# EAGLE design LPmini-Prototype_1.4 (EAGLE 6.4)
COMPANY: ADAFRUIT INDUSTRIES; DRAWN: KTOWN; REV: B
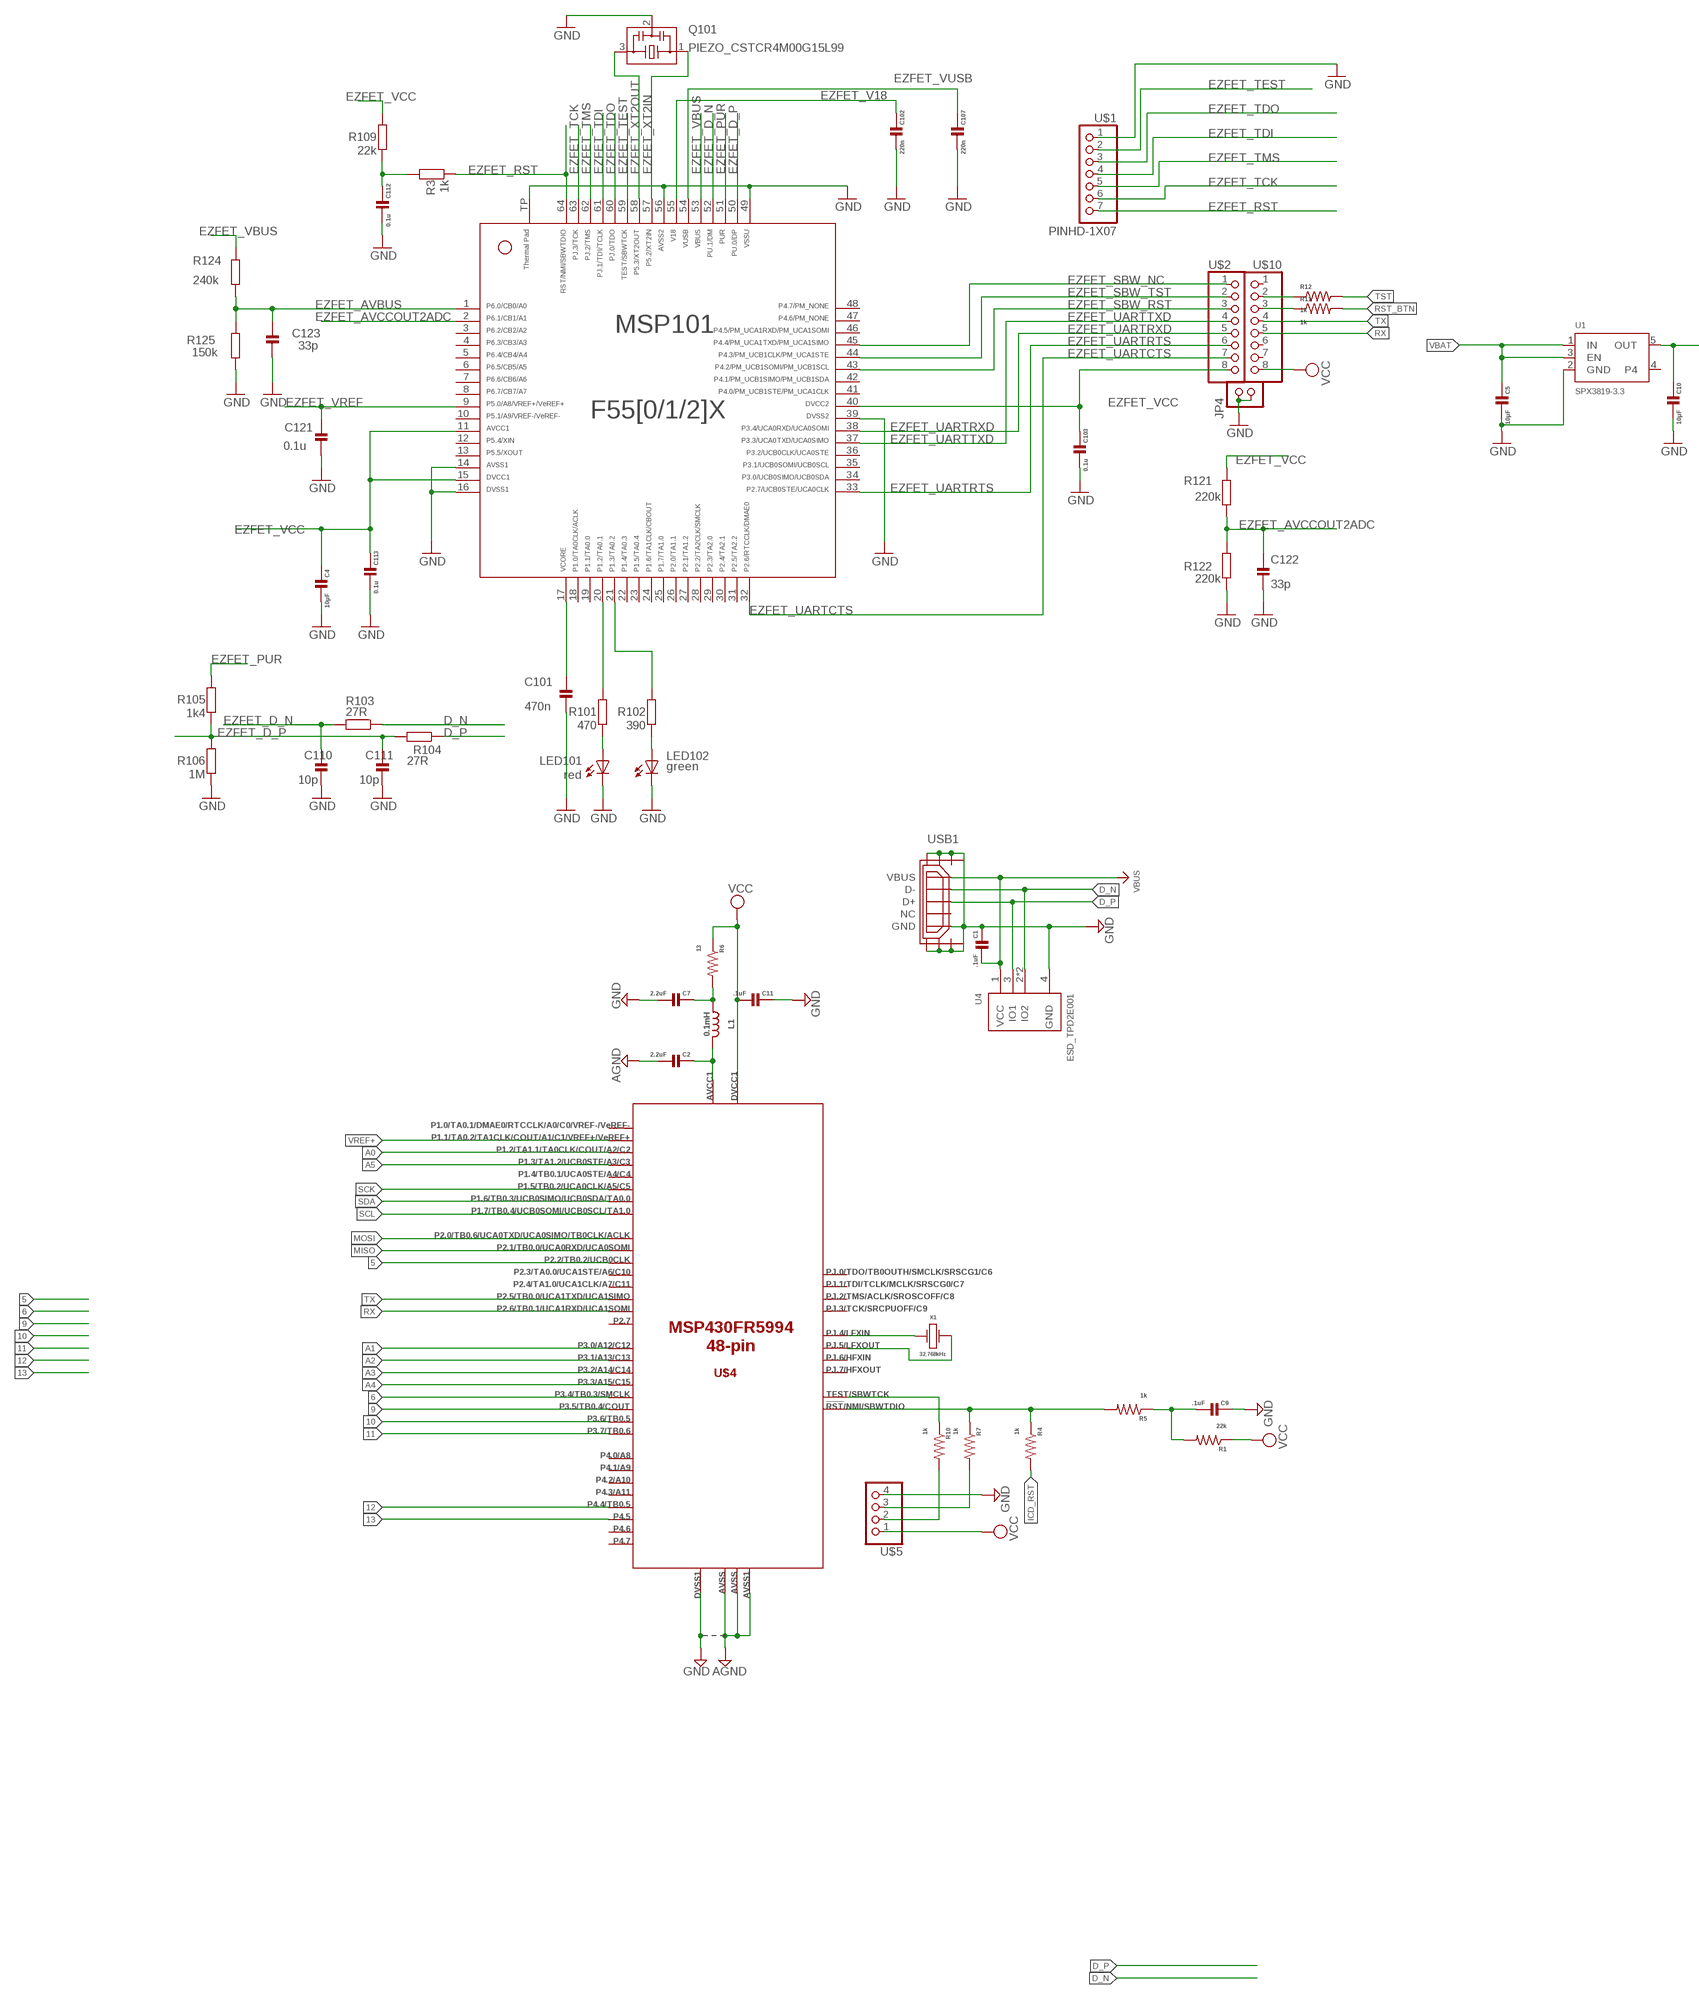
[diagram p0: schematic, sheet 1, part 1 of 2]
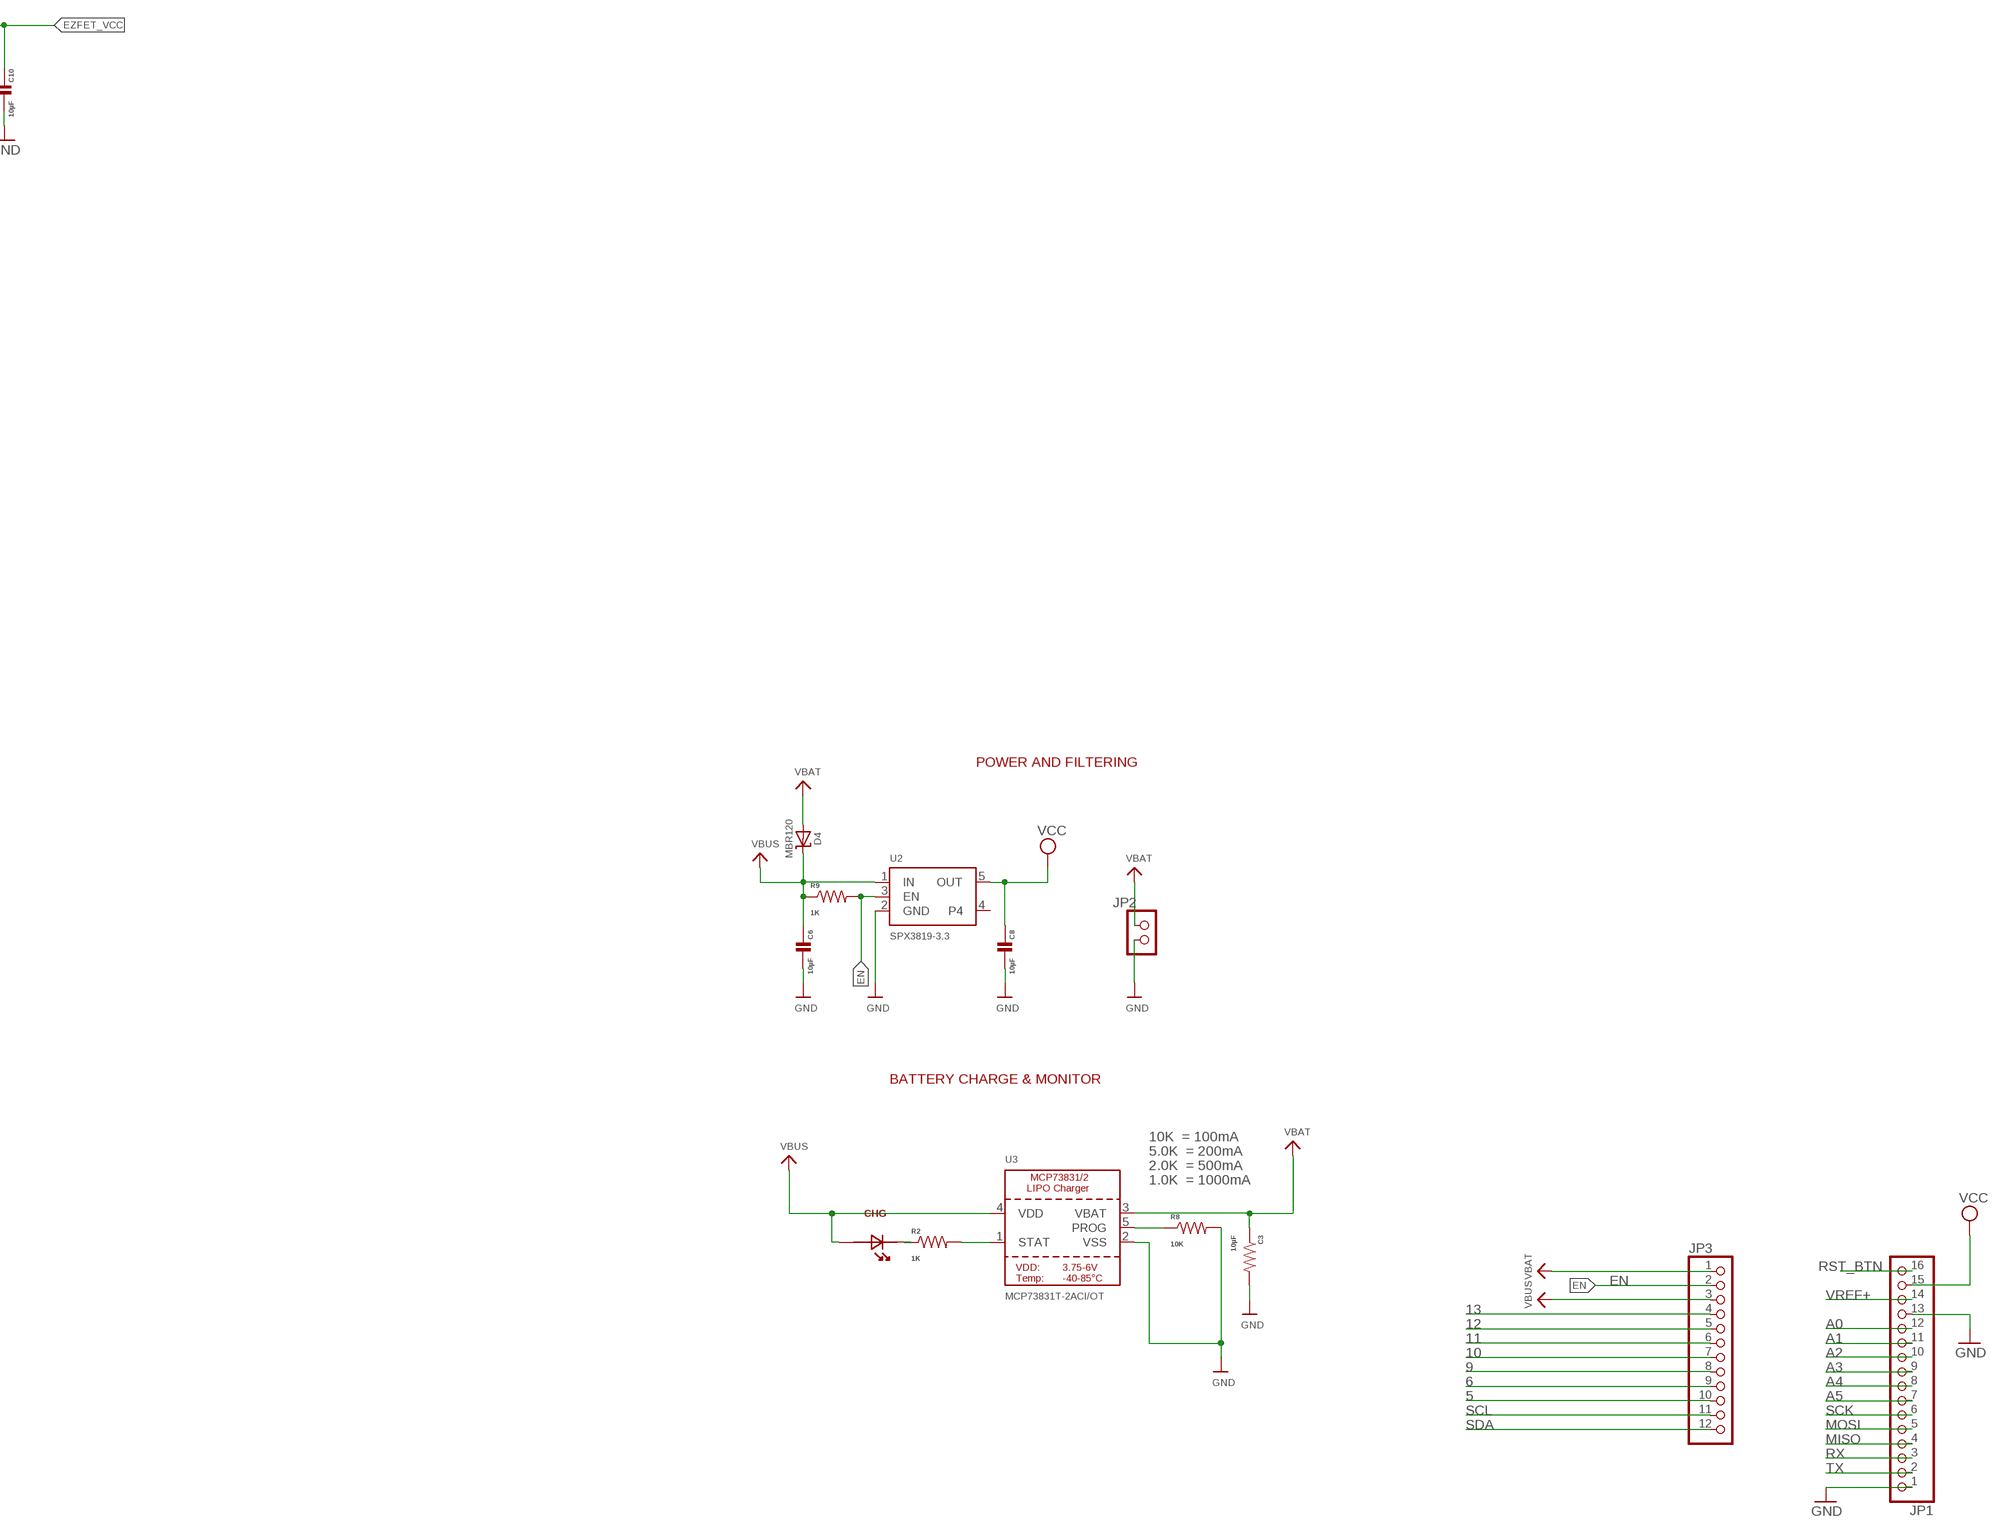
[diagram p1: schematic, sheet 1, part 2 of 2]

## Parts
C1  .1uF  C-EUC0402  [C0402]
C2  2.2uF  C-EUC0603  [C0603]
C3  10µF  R-US_R0402  [R0402]
C4  10µF  C-EUC0603  [C0603]
C5  10µF  C-EUC0603  [C0603]
C6  10µF  C-EUC0603  [C0603]
C7  2.2uF  C-EUC0603  [C0603]
C8  10µF  C-EUC0603  [C0603]
C9  .1uF  C-EUC0402  [C0402]
C10  10µF  C-EUC0603  [C0603]
C11  .1uF  C-EUC0402  [C0402]
C101  470n  C-EUC0402  [C0402]
C102  220n  C-EUC0402  [C0402]
C103  0.1u  C-EUC0402  [C0402]
C107  220n  C-EUC0402  [C0402]
C110  10p  C-EUC0402  [C0402]
C111  10p  C-EUC0402  [C0402]
C112  0.1u  C-EUC0402  [C0402]
C113  0.1u  C-EUC0402  [C0402]
C121  0.1u  C-EUC0402  [C0402]
C122  33p  C-EUC0402  [C0402]
C123  33p  C-EUC0402  [C0402]
CHG  ORANGE  LED0603  [LED_0603]
D4  MBR120  DIODE-SCHOTTKYSOD-123  [SOD-123]
JP1  HEADER-1X16ROUND  [1X16_ROUND]
JP2  0_JOSEPH_PINHD-1X2END  [0_JOSEPH_1X02-END]
JP3  HEADER-1X12  [1X12_ROUND]
JP4  0_JOSEPH_PINHD-1X2SMALL  [0_JOSEPH_1X02-SMALL]
L1  0.1mH  SMD_INDUCT0805  [RCL_R0805]
LED101  red  LEDCHIP-LED0603  [CHIP-LED0603]
LED102  green  LEDCHIP-LED0603  [CHIP-LED0603]
MSP101  MSP430F5528IRGC  F55[0/1/2]X---RGC64  [RGC64]
Q101  PIEZO_CSTCR4M00G15L99  MURATA-FILTER_CSTCR6M00G53Z  [MURATA-FILTER_CSTCR]
R1  22k  R-US_R0402  [R0402]
R2  1K  R-US_R0402  [R0402]
R3  1k  R-EU_R0402  [R0402]
R4  1k  R-US_R0402  [R0402]
R5  1k  R-US_R0402  [R0402]
R6  13  R-US_R0402  [R0402]
R7  1k  R-US_R0402  [R0402]
R8  10K  R-US_R0402  [R0402]
R9  1K  R-US_R0402  [R0402]
R10  1k  R-US_R0402  [R0402]
R11  1k  R-US_R0402  [R0402]
R12  1k  R-US_R0402  [R0402]
R101  470  R-EU_R0402  [R0402]
R102  390  R-EU_R0402  [R0402]
R103  27R  R-EU_R0402  [R0402]
R104  27R  R-EU_R0402  [R0402]
R105  1k4  R-EU_R0402  [R0402]
R106  1M  R-EU_R0402  [R0402]
R109  22k  R-EU_R0402  [R0402]
R121  220k  R-EU_R0402  [R0402]
R122  220k  R-EU_R0402  [R0402]
R124  240k  R-EU_R0402  [R0402]
R125  150k  R-EU_R0402  [R0402]
U1  SPX3819-3.3  VREG_SOT23-5  [SOT23-5]
U2  SPX3819-3.3  VREG_SOT23-5  [SOT23-5]
U3  MCP73831T-2ACI/OT  MCP73831/2  [SOT23-5]
U4  ESD_TPD2E001  [PROJECT7264_TPD2E001-DRL]
U$1  PINHD-1X07  [1X07]
U$2  PINHD-1X08SMALL  [1X08-SMALL]
U$4  MSP430FR5994-48PIN  [48QFN]
U$5  PINHD_1X4  [1X04]
U$10  PINHD-1X08SMALL  [1X08-SMALL]
USB1  USB_CON-UPDATE_USB_MICRO_FLIPPED  [USB_CON-UPDATE_HIROSE-ZX62R-B-5P]
X1  32.768kHz  CRYSTALABS-05  [CRYSTAL_ABS05]

## Nets
5: JP3.10 U$4.26
6: JP3.9 U$4.27
9: JP3.8 U$4.28
10: JP3.7 U$4.29
11: JP3.6 U$4.30
12: JP3.5 U$4.33
13: JP3.4 U$4.34
A0: JP1.12 U$4.3
A1: JP1.11 U$4.4
A2: JP1.10 U$4.5
A3: JP1.9 U$4.6
A4: JP1.8 U$4.7
A5: JP1.7 U$4.9
AGND: C2.2 U$4.41 U$4.44 U$4.47
D_N: R103.1 U4.2(IO2) U4.5(IO2) USB1.D-
D_P: R104.1 U4.3(IO1) USB1.D+
EN: JP3.2 R9.2 U2.3(EN)
EZFET_AVBUS: C123.2 MSP101.1 R124.2 R125.1
EZFET_AVCCOUT2ADC: C122.2 MSP101.2 R121.2 R122.1
EZFET_D_N: C110.1 MSP101.52 R103.2
EZFET_D_P: C111.1 MSP101.50 R104.2 R105.1 R106.2
EZFET_LED0: MSP101.20 R101.2
EZFET_LED1: MSP101.21 R102.2
EZFET_PUR: MSP101.51 R105.2
EZFET_RST: MSP101.64 R3.1 U$1.7
EZFET_SBW_NC: MSP101.45 U$2.1
EZFET_SBW_RST: MSP101.43 U$2.3
EZFET_SBW_TST: MSP101.44 U$2.2
EZFET_TCK: MSP101.63 U$1.6
EZFET_TDI: MSP101.61 U$1.4
EZFET_TDO: MSP101.60 U$1.3
EZFET_TEST: MSP101.59 U$1.2
EZFET_TMS: MSP101.62 U$1.5
EZFET_UARTCTS: MSP101.32 U$2.7
EZFET_UARTRTS: MSP101.33 U$2.6
EZFET_UARTRXD: MSP101.38 U$2.5
EZFET_UARTTXD: MSP101.37 U$2.4
EZFET_V18 [Ethernet]: C102.1 MSP101.55
EZFET_VBUS [Ethernet]: MSP101.53 R124.1
EZFET_VCC [Ethernet]: C4.1 C10.1 C103.1 C113.1 MSP101.11 MSP101.15 MSP101.40 R109.2 R121.1 U1.5(OUT) U$2.8
EZFET_VREF [Ethernet]: C121.1 MSP101.9
EZFET_VUSB [Ethernet]: C107.1 MSP101.54
EZFET_XT2IN: MSP101.57 Q101.1
EZFET_XT2OUT: MSP101.58 Q101.3
GND: C1.1 C3.2 C4.2 C5.2 C6.2 C7.2 C8.2 C9.1 C10.2 C11.1 C101.2 C102.2 C103.2 C107.2 C110.2 C111.2 C112.2 C113.2 C121.2 C122.1 C123.1 JP1.1 JP1.13 JP2.2 JP4.1 JP4.2 LED101.C LED102.C MSP101.14 MSP101.16 MSP101.39 MSP101.49 MSP101.56 MSP101.TP Q101.2 R8.2 R106.1 R122.2 R125.2 U1.2(GND) U2.2(GND) U3.2(VSS) U4.4(GND) U$1.1 U$4.36 U$4.TAB U$5.4 USB1.GND USB1.SHIELD1 USB1.SHIELD2 USB1.SHIELD3 USB1.SHIELD4 USB1.SHIELD5 USB1.SHIELD6
ICD_RST: R4.2
MISO: JP1.4 U$4.25
MOSI: JP1.5 U$4.24
N$1: CHG.K(C) R2.1
N$2: C9.2 R1.2 R5.1
N$3: R2.2 U3.1(STAT)
N$4: R8.1 U3.5(PROG)
N$5: U$4.46 X1.P$2
N$6: R11.1 U$10.3
N$7: R10.1 U$4.22
N$8: C112.1 R3.2 R109.1
N$9: R12.1 U$10.2
N$11: U$4.45 X1.P$1
N$14: C2.1 L1.1 U$4.48
N$15: C7.1 L1.2 R6.2
N$18: C101.1 MSP101.17
N$19: LED101.A R101.1
N$20: LED102.A R102.1
RST: R4.1 R5.2 R7.1 U$4.23
RST_BTN: JP1.16 R7.2 R11.2 U$5.3
RX: JP1.3 U$4.21 U$10.5
SCK: JP1.6 U$4.11
SCL: JP3.11 U$4.32
SDA: JP3.12 U$4.31
TST: R10.2 R12.2 U$5.2
TX: JP1.2 U$4.20 U$10.4
VBAT: C3.1 C5.1 D4.A JP2.1 JP3.1 U1.1(IN) U1.3(EN) U3.3(VBAT)
VBUS: C1.2 C6.1 CHG.A D4.C JP3.3 R9.1 U2.1(IN) U3.4(VDD) U4.1(VCC) USB1.VBUS
VCC: C8.1 C11.2 JP1.15 R1.1 R6.1 U2.5(OUT) U$4.37 U$5.1 U$10.8
VREF+: JP1.14 U$4.2
Unconnected: MSP101.3 MSP101.4 MSP101.5 MSP101.6 MSP101.7 MSP101.8 MSP101.10 MSP101.12 MSP101.13 MSP101.18 MSP101.19 MSP101.22 MSP101.23 MSP101.24 MSP101.25 MSP101.26 MSP101.27 MSP101.28 MSP101.29 MSP101.30 MSP101.31 MSP101.34 MSP101.35 MSP101.36 MSP101.41 MSP101.42 MSP101.46 MSP101.47 MSP101.48 U1.4 U2.4 U$4.1 U$4.8 U$4.10 U$4.12 U$4.13 U$4.14 U$4.15 U$4.16 U$4.17 U$4.18 U$4.19 U$4.35 U$4.38 U$4.39 U$4.40 U$4.42 U$4.43 U$10.1 U$10.6 U$10.7 USB1.NC

## Notes on the sheet
- POWER AND FILTERING
- BATTERY CHARGE & MONITOR
- 10K  = 100mA
- 5.0K  = 200mA
- 2.0K  = 500mA
- 1.0K  = 1000mA

## Library data of the parts
C1 C2 C4-C11 C101-C103 C107 C110-C113 C121-C123 = rcl:C-EU: CAPACITOR, European symbol
C3 R1 R2 R4-R12 = rcl:R-US_: RESISTOR, American symbol
CHG = 0Joseph:LED
D4 = microbuilder:DIODE-SCHOTTKY
JP1 = microbuilder:HEADER-1X16: PIN HEADER
JP2 JP4 = 0Joseph:0_JOSEPH_PINHD-1X2: PIN HEADER
JP3 = microbuilder:HEADER-1X12
L1 = 0Joseph:SMD_INDUCT
LED101 LED102 = led:LED: LED OSRAM: - CHIPLED LG R971, LG N971, LY N971, LG Q971, LY Q971, LO R971, LY R971 LH N974, LH R974 LS Q976, LO Q976, LY Q976 LO Q996 - Hyper CHIPLED LW Q18S LB Q993, LB Q99A, LB R99A - SideLED LS A670, LO A670, LY A670, LG A670, LP A670 LB A673, LV A673, LT A673, LW A673 LH A674 LY A675 LS A676, LA A676, LO A676, LY A676, LW A676 LS A679, LY A679, LG A679 - Hyper Micro SIDELED® LS Y876, LA Y876, LO Y876, LY Y876 LT Y87S - SmartLED LW L88C, LW L88S LB L89C, LB L89S, LG L890 LS L89K, LO L89K, LY L89K LS L896, LA L896, LO L896, LY L896 - TOPLED LS T670, LO T670, LY T670, LG T670, LP T670 LSG T670, LSP T670, LSY T670, LOP T670, LYG T670 LG T671, LOG T671, LSG T671 LB T673, LV T673, LT T673, LW T673 LH T674 LS T676, LA T676, LO T676, LY T676, LB T676, LH T676, LSB T676, LW T676 LB T67C, LV T67C, LT T67C, LS T67K, LO T67K, LY T67K, LW E67C LS E67B, LA E67B, LO E67B, LY E67B, LB E67C, LV E67C, LT E67C LW T67C LS T679, LY T679, LG T679 LS T770, LO T770, LY T770, LG T770, LP T770 LB T773, LV T773, LT T773, LW T773 LH T774 LS E675, LA E675, LY E675, LS T675 LS T776, LA T776, LO T776, LY T776, LB T776 LHGB T686 LT T68C, LB T68C - Hyper Mini TOPLED® LB M676 - Mini TOPLED Santana® LG M470 LS M47K, LO M47K, LY M47K Source: http://www.osram.convergy.de LUXEON: - LUMILED® LXK2-PW12-R00, LXK2-PW12-S00, LXK2-PW14-U00, LXK2-PW14-V00 LXK2-PM12-R00, LXK2-PM12-S00, LXK2-PM14-U00 LXK2-PE12-Q00, LXK2-PE12-R00, LXK2-PE12-S00, LXK2-PE14-T00, LXK2-PE14-U00 LXK2-PB12-K00, LXK2-PB12-L00, LXK2-PB12-M00, LXK2-PB14-N00, LXK2-PB14-P00, LXK2-PB14-Q00 LXK2-PR12-L00, LXK2-PR12-M00, LXK2-PR14-Q00, LXK2-PR14-R00 LXK2-PD12-Q00, LXK2-PD12-R00, LXK2-PD12-S00 LXK2-PH12-R00, LXK2-PH12-S00 LXK2-PL12-P00, LXK2-PL12-Q00, LXK2-PL12-R00 Source: www.luxeon.com KINGBRIGHT: KA-3528ASYC Source: www.kingbright.com
MSP101 = TI_MSP430_v16_intern:F55[0/1/2]X---RGC64: ***F55[0/1/2]X***RGC64 Rev. 1.0 06/2010 "http://www.ti.com/lit/gpn/msp430f5529" "http://www.ti.com/lit/gpn/msp430f5509" F5513/F5514 with limited Functions on some Pins
Q101 = murata:MURATA-FILTER_CSTCR: Resonator Source: murata.co.jp; MPN: CSTCR6M00G53-R0; OC_FARNELL: 1170434; OC_NEWARK: 25M8759
R3 R101-R106 R109 R121 R122 R124 R125 = rcl:R-EU_: RESISTOR, European symbol
U1 U2 = microbuilder:VREG_SOT23-5: SOT23-5 Fixed Voltage Regulators Part Current Out V Out V In V Dropout θJA (°C/W) TJ (°C) Digikey Part No. ADP121 150mA 3.3V 3.4-5.5V 0.09V @ 150mA -- -- ADP121-AUJZ33R7CT-ND ADP121 150mA 3.0V 3.1-5.5V 0.09V @ 150mA -- -- ADP121-AUJZ30R7CT-ND ADP122 300mA 3.3V 3.4-5.5V 0.085V @ 300mA -- -- ADP122AUJZ-3.3-R7CT-ND ADP1712 300mA 3.3V 3.5-5.5V 0.17V @ 300mA -- -- ADP1712AUJZ-3.3-R7TR-ND AP7311 (Low Cost) 150mA 3.3V 3.5-6V 0.15V @ 150mA -- -- AP7311-33WG-7DICT-ND LD39015M18R 150mA 1.8V 1.9V-5.5V 0.08V @ 100mA -- -- 497-6977-1-ND LP2985A-33DBVR 150mA 3.3V 3.3-16V 0.28V @ 150mA 206 150 296-18479-1-ND MCP1824T-3302E/OT 300mA 3.3V 3.5V-6V 0.2V @ 300mA -- -- MCP1824T-3302E/OTCT-ND MIC5205-2.5YM5 TR 150mA 2.5V 2.7-16V 0.165V @ 150mA -- -- 576-1257-2-ND MIC5205-3.0YM5 TR 150mA 3.0V 3.2V-16V 0.165V @ 150mA -- -- 576-1258-2-ND MIC5205-3.3YM5 TR 150mA 3.3V 3.5V-16V 0.165V @ 150mA -- -- 576-1259-2-ND TPS780330220 150mA 3.3V+2.2V 3.6-5.5V 250mV Max -- -- 296-23332-1-ND TDA3663/N1,135 100mA 3.3V 3.5-45V 0.18V @ 50mA -- -- 568-5343-1-ND Max operating temp can be calculated using θJA, TJ (max junction temperature), and power in watts. Set the "Maximum Ambient Temperature" until it reaches TJ ("Max Junction Temperature"), which is the absolute limit for safe use of the regulator: Heat Sink Temperature Calculator <http://www.daycounter.com/Calculators/Heat-Sink-Temperature-Calculator.phtml> For example, With 12V source into a 3.3V LP2985 and a 30mA load, we are dissipating (12V-3.3V) * 0.03A = 0.261W. With a θJA of 206 °C/W, a TJ of 150°C, and 261mW we can safely use the chip without a heat sink up to 75°C (=147.1°C Junction Temperature).
U3 = microbuilder:MCP73831/2: MCP73831/2 LIPO Charger VDD: 3.75 - 6V Temp -40 - 85°C Programmable Charge Rate: 15-500mA NOTE: STAT is a tri-state logic output on the MCP73831 and an open-drain output on the MCP73832. SOT23-5 with 4.2V output and tri-state logic on STAT = MCP73831T-2ACI/OT
U4 = 0Joseph:ESD_TPD2E001: TPD2E001 ESD-protection diode array
U$1 = 0Joseph:PINHD-1X07
U$2 U$10 = 0Joseph:PINHD-1X08
U$4 = 0Joseph:MSP430FR5994-48PIN
U$5 = 0Joseph:PINHD_1X4
USB1 = 0Joseph:USB_CON-UPDATE_USB_MICRO_FLIPPED
X1 = 0_Joseph:CRYSTAL

## Net classes
1 Ground: width 0.203 mm, drill 0.305 mm, clearance 0.152 mm to class 0, clearance 0.152 mm
2 Ethernet: width 0.22 mm, clearance 0.152 mm

## Board
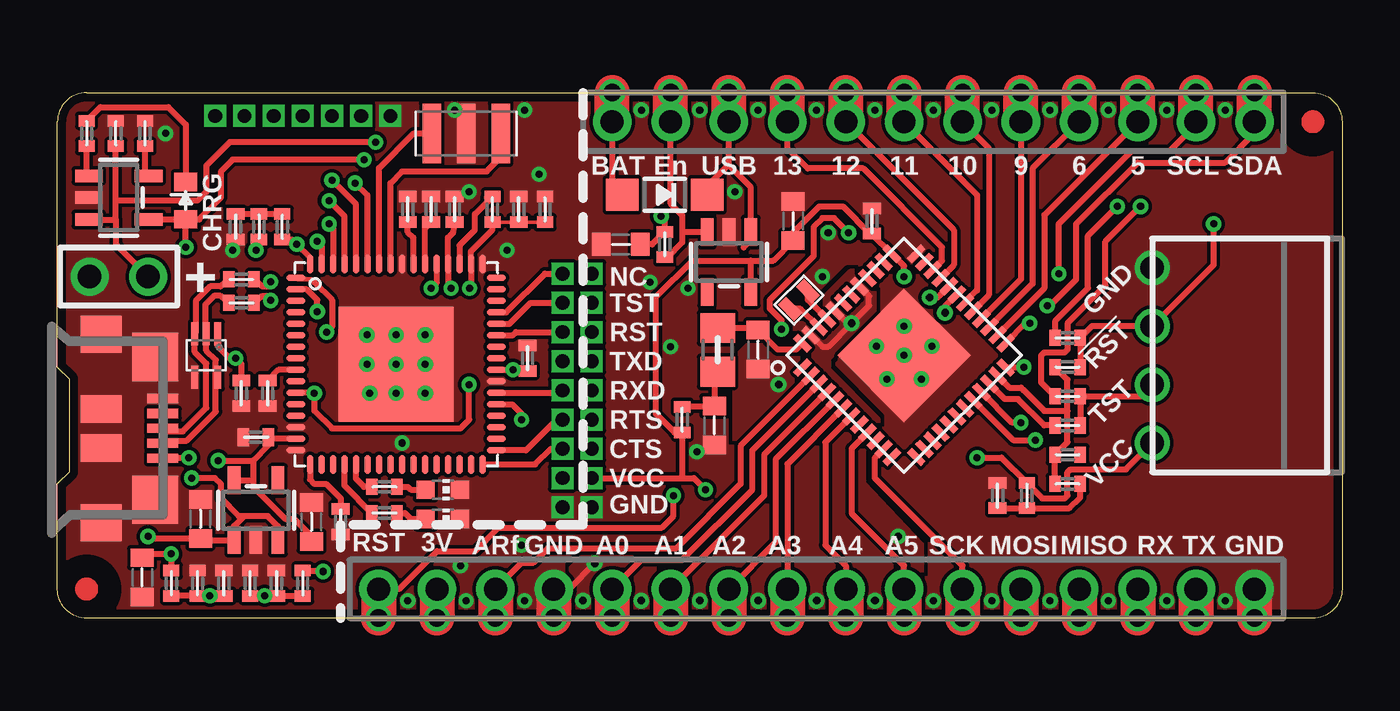
[diagram p2: board, top side]
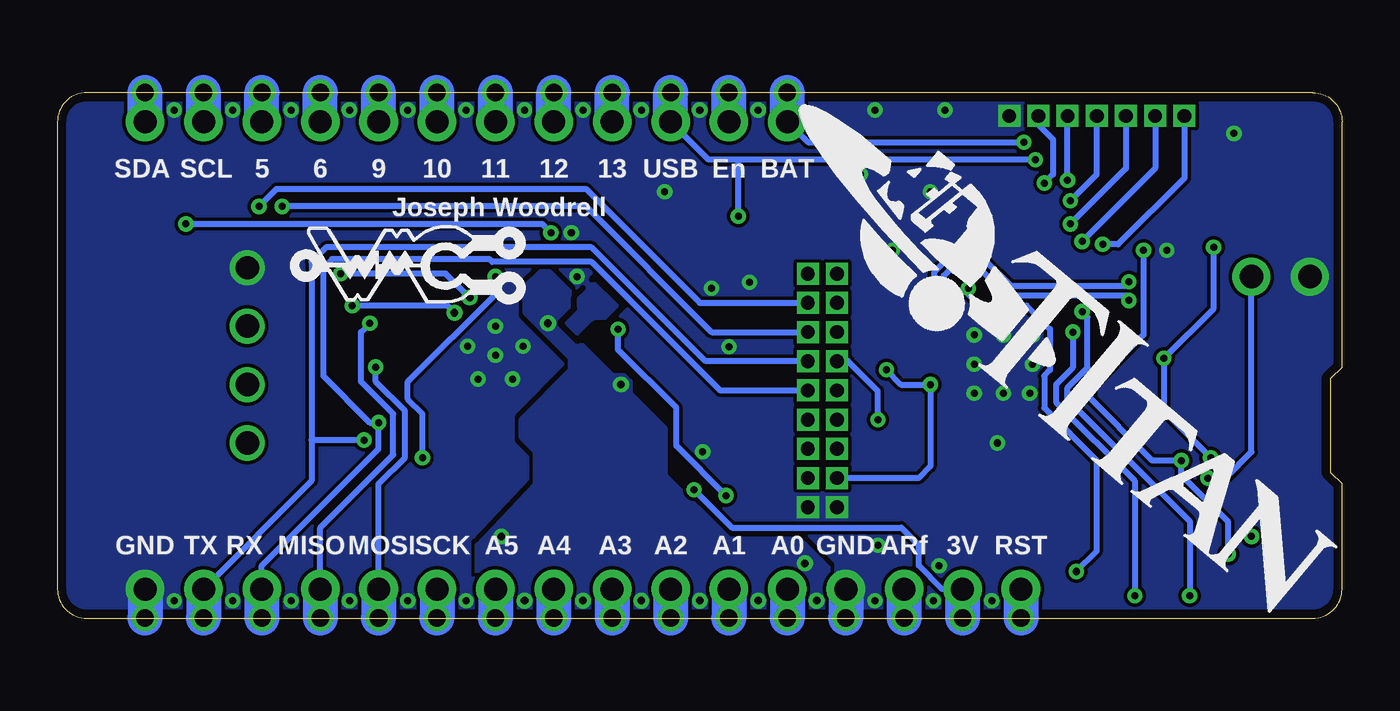
[diagram p3: board, bottom side, seen from below]

Size 55.88 x 22.86 mm. Coordinates in mm from the lower left corner, seen from the top.
Outline: 1.27,22.86 54.61,22.86 arc-90 55.88,21.59 55.88,1.27 arc-90 54.61,0 1.27,0 arc-90 0,1.27 0,5.84 0.51,6.35 0.51,10.41 0,10.92 0,21.59 arc-90 1.27,22.86
Copper layers (1*16): Top 0.0356mm / dielectric 1.5011mm / Bottom 0.0356mm
Design rules "JWoodrell": minimum track width 6mil, minimum drill 12mil, track to track 6mil, track to pad 6mil, pad to pad 6mil, via to via 6mil, smd to smd 0mil, copper to edge 15mil, drill to drill 6mil, minimum pad ring 7mil, minimum via ring 7mil, stop-mask expansion 1mil, vias tented up to drill 20mil, thermal gap 6mil
bRestrict: 9 lines

### Footprints (pad centres in the part's own frame; a part is rotated, then mirrored left to right if it is on the bottom)
C0402 = smd 0.5 x 0.775: 1 -0.55,0; 2 0.55,0
C0603 = smd 0.8 x 1: 1 -0.85,0; 2 0.85,0
R0402 = smd 0.5 x 0.7: 1 -0.55,0; 2 0.55,0
LED_0603 = smd 0.8 x 1: A -0.813,0; K 0.813,0
SOD-123 = smd 1.4 x 1.4: A 1.85,0; C -1.85,0
1X16_ROUND = drill 1 pad 1.676: 1 -19.05,0; 2 -16.51,0; 3 -13.97,0; 4 -11.43,0; 5 -8.89,0; 6 -6.35,0; 7 -3.81,0; 8 -1.27,0; 9 1.27,0; 10 3.81,0; 11 6.35,0; 12 8.89,0; 13 11.43,0; 14 13.97,0; 15 16.51,0; 16 19.05,0
0_JOSEPH_1X02-END = drill 1.016 pad 1.651: 1 -1.27,0; 2 1.27,0
1X12_ROUND = drill 1 pad 1.676: 1 -13.97,0; 2 -11.43,0; 3 -8.89,0; 4 -6.35,0; 5 -3.81,0; 6 -1.27,0; 7 1.27,0; 8 3.81,0; 9 6.35,0; 10 8.89,0; 11 11.43,0; 12 13.97,0
0_JOSEPH_1X02-SMALL = drill 0.6 pad 0.889 square: 1 -0.635,0; 2 0.635,0
RCL_R0805 = smd 1.3 x 1.5: 1 -0.95,0; 2 0.95,0
CHIP-LED0603 = smd 0.8 x 0.8: A 0,-0.75; C 0,0.75
RGC64 = smd 0.825 x 0.28: 1 -4.36,3.75; 2 -4.36,3.25; 3 -4.36,2.75; 4 -4.36,2.25; 5 -4.36,1.75; 6 -4.36,1.25; 7 -4.36,0.75; 8 -4.36,0.25; 9 -4.36,-0.25; 10 -4.36,-0.75; 11 -4.36,-1.25; 12 -4.36,-1.75; 13 -4.36,-2.25; 14 -4.36,-2.75; 15 -4.36,-3.25; 16 -4.36,-3.75; 33 4.36,-3.75; 34 4.36,-3.25; 35 4.36,-2.75; 36 4.36,-2.25; 37 4.36,-1.75; 38 4.36,-1.25; 39 4.36,-0.75; 40 4.36,-0.25; 41 4.36,0.25; 42 4.36,0.75; 43 4.36,1.25; 44 4.36,1.75; 45 4.36,2.25; 46 4.36,2.75; 47 4.36,3.25; 48 4.36,3.75 | smd 0.28 x 0.825: 17 -3.75,-4.36; 18 -3.25,-4.36; 19 -2.75,-4.36; 20 -2.25,-4.36; 21 -1.75,-4.36; 22 -1.25,-4.36; 23 -0.75,-4.36; 24 -0.25,-4.36; 25 0.25,-4.36; 26 0.75,-4.36; 27 1.25,-4.36; 28 1.75,-4.36; 29 2.25,-4.36; 30 2.75,-4.36; 31 3.25,-4.36; 32 3.75,-4.36; 49 3.75,4.36; 50 3.25,4.36; 51 2.75,4.36; 52 2.25,4.36; 53 1.75,4.36; 54 1.25,4.36; 55 0.75,4.36; 56 0.25,4.36; 57 -0.25,4.36; 58 -0.75,4.36; 59 -1.25,4.36; 60 -1.75,4.36; 61 -2.25,4.36; 62 -2.75,4.36; 63 -3.25,4.36; 64 -3.75,4.36 | smd 5 x 5: TP 0,0
MURATA-FILTER_CSTCR = smd 0.8 x 2.6: 1 -1.5,0; 2 0,0; 3 1.5,0
SOT23-5 = smd 0.55 x 1.2: 1 -0.95,-1.3; 2 0,-1.3; 3 0.95,-1.3; 4 0.95,1.3; 5 -0.95,1.3
PROJECT7264_TPD2E001-DRL = smd 0.3 x 1: 1 -0.5,-0.95; 2 0,-0.95; 3 0.5,-0.95; 4 0.5,0.95; 5 -0.5,0.95
1X07 = drill 0.6 pad 0.889 square: 1 -3.81,0; 2 -2.54,0; 3 -1.27,0; 4 0,0; 5 1.27,0; 6 2.54,0; 7 3.81,0
1X08-SMALL = drill 0.6 pad 0.889 square: 1 -4.445,0; 2 -3.175,0; 3 -1.905,0; 4 -0.635,0; 5 0.635,0; 6 1.905,0; 7 3.175,0; 8 4.445,0
48QFN = smd 0.3 x 0.85: 1 -2.75,-3.5; 2 -2.25,-3.5; 3 -1.75,-3.5; 4 -1.25,-3.5; 5 -0.75,-3.5; 6 -0.25,-3.5; 7 0.25,-3.5; 8 0.75,-3.5; 9 1.25,-3.5; 10 1.75,-3.5; 11 2.25,-3.5; 12 2.75,-3.5; 25 2.75,3.5; 26 2.25,3.5; 27 1.75,3.5; 28 1.25,3.5; 29 0.75,3.5; 30 0.25,3.5; 31 -0.25,3.5; 32 -0.75,3.5; 33 -1.25,3.5; 34 -1.75,3.5; 35 -2.25,3.5; 36 -2.75,3.5 | smd 0.85 x 0.3: 13 3.5,-2.75; 14 3.5,-2.25; 15 3.5,-1.75; 16 3.5,-1.25; 17 3.5,-0.75; 18 3.5,-0.25; 19 3.5,0.25; 20 3.5,0.75; 21 3.5,1.25; 22 3.5,1.75; 23 3.5,2.25; 24 3.5,2.75; 37 -3.5,2.75; 38 -3.5,2.25; 39 -3.5,1.75; 40 -3.5,1.25; 41 -3.5,0.75; 42 -3.5,0.25; 43 -3.5,-0.25; 44 -3.5,-0.75; 45 -3.5,-1.25; 46 -3.5,-1.75; 47 -3.5,-2.25; 48 -3.5,-2.75 | smd 4.1 x 4.1: TAB 0,0
1X04 = drill 1.016: 1 -3.81,0; 2 -1.27,0; 3 1.27,0; 4 3.81,0
USB_CON-UPDATE_HIROSE-ZX62R-B-5P = smd 1.35 x 0.4: D+ 2.675,0; D- 2.675,-0.65; GND 2.675,1.3; NC 2.675,0.65; VBUS 2.675,-1.3 | smd 1.778 x 1.6: SHIELD1 0,4.1; SHIELD2 0,-4.1 | smd 2 x 2.1: SHIELD3 2.35,3.1; SHIELD4 2.35,-3.1 | smd 1.778 x 1.2: SHIELD5 0,0.85; SHIELD6 0,-0.85
CRYSTAL_ABS05 = smd 0.5 x 1: P$1 -0.55,0; P$2 0.55,0

### Placement (x,y rotation side)
C1  8,9.78 90 top
C2  30.48,11.68 270 top
C3  2.54,21.08 90 top
C4  3.68,1.78 270 top
C5  6.22,4.32 90 top
C6  24.51,16.26 180 top
C7  28.57,8.38 270 top
C8  32,17.27 90 top
C9  40.89,5.33 270 top
C10  11.05,4.19 90 top
C11  35.43,17.27 270 top
C101  12.32,4.19 270 top
C102  15.24,17.78 90 top
C103  8.64,7.87 180 top
C107  16.26,17.78 90 top
C110  17.27,17.78 90 top
C111  20.07,17.78 90 top
C112  7.75,17.02 270 top
C113  20.45,11.3 90 top
C121  9.14,9.78 270 top
C122  7.24,1.52 270 top
C123  9.53,1.52 270 top
CHG  5.59,18.16 90 top
D4  26.42,18.41 180 top
JP1  33.02,1.27 180 top
JP2  2.67,14.86 180 top
JP3  38.1,21.59 0 top
JP4  22.61,4.83 0 top
L1  28.72,11.67 270 top
LED101  16.76,4.32 270 top
LED102  16.76,5.59 270 top
MSP101  14.73,11.05 0 top
Q101  17.78,21.08 180 top
R1  42.16,5.33 270 top
R2  1.27,21.08 270 top
R3  9.78,17.02 90 top
R4  43.94,7.11 0 top
R5  43.94,5.84 180 top
R6  27.18,8.64 90 top
R7  43.94,10.92 0 top
R8  3.81,21.08 90 top
R9  26.42,16.26 270 top
R10  43.94,8.38 0 top
R11  43.94,12.19 0 top
R12  43.94,9.65 0 top
R101  14.22,4.57 180 top
R102  14.22,5.71 180 top
R103  8,13.72 0 top
R104  8,14.73 0 top
R105  18.92,17.78 90 top
R106  21.21,17.78 270 top
R109  8.76,17.02 270 top
R121  4.95,1.52 270 top
R122  6.1,1.52 90 top
R124  10.67,1.52 270 top
R125  8.38,1.52 90 top
U1  8.64,4.7 0 top
U2  29.21,15.49 180 top
U3  2.67,18.29 270 top
U4  6.48,11.43 180 top
U$1  10.67,21.84 180 top
U$2  21.97,10.54 270 top
U$4  36.83,11.43 315 top
U$5  47.62,11.43 90 top
U$7  [TITAN_LOGO]  11.86,10.7 320 bottom
U$8  [FIDUCIAL]  1.27,1.27 0 top
U$9  [FIDUCIAL]  54.61,21.59 0 top
U$10  23.24,10.54 270 top
U$11  [WMC_LOGO_400MILWIDE]  45.72,13.72 0 bottom
USB1  1.91,8.25 0 top
X1  32.26,13.84 225 top

### Tracks (layer width: path | path; a pad name or v marks a point on that pad's centre or on a via)
5  (via drill 0.76)
  Top 0.254: JP3.10 42.93,17.53 42.93,14.34 U$4.26
  Top 1.524: JP3.10 v46.99,22.86
  Bottom 1.524: JP3.10 v46.99,22.86
6  (via drill 0.76)
  Top 0.254: JP3.9 42.42,19.56 42.42,14.54 U$4.27
  Top 1.524: JP3.9 v44.45,22.86
  Bottom 1.524: JP3.9 v44.45,22.86
9  (via drill 0.76)
  Top 0.254: JP3.8 41.91,14.74 U$4.28
  Top 1.524: JP3.8 v41.91,22.86
  Bottom 1.524: JP3.8 v41.91,22.86
10  (via drill 0.76)
  Top 0.254: JP3.7 40.51,20.45 40.51,14.05 U$4.29
  Top 1.524: JP3.7 v39.37,22.86
  Bottom 1.524: JP3.7 v39.37,22.86
11  (via drill 0.76)
  Top 0.254: JP3.6 40.01,18.41 40.01,14.25 U$4.30
  Top 1.524: JP3.6 v36.83,22.86
  Bottom 1.524: JP3.6 v36.83,22.86
12  (via drill 0.76)
  Top 0.254: JP3.5 38.99,16.89 38.99,15.36 U$4.33
  Top 1.524: JP3.5 v34.29,22.86
  Bottom 1.524: JP3.5 v34.29,22.86
13  (via drill 0.76)
  Top 0.254: U$4.34 38.48,15.56 38.48,16.13 35.05,19.56 32.64,19.56 31.75,20.45 JP3.4
  Top 1.524: JP3.4 v31.75,22.86
  Bottom 1.524: JP3.4 v31.75,22.86
A0  (via drill 0.76)
  Top 0.254: JP1.12 25.4,2.54 27.18,2.54 30.23,5.59 30.23,7.3 U$4.3
  Top 1.524: JP1.12 v24.13,0
  Bottom 1.524: JP1.12 v24.13,0
A1  (via drill 0.76)
  Top 0.254: U$4.4 30.73,7.1 30.73,5.33 JP1.11
  Top 1.524: JP1.11 v26.67,0
  Bottom 1.524: JP1.11 v26.67,0
A2  (via drill 0.76)
  Top 0.254: U$4.5 31.24,6.9 31.24,3.3 JP1.10
  Top 1.524: JP1.10 v29.21,0
  Bottom 1.524: JP1.10 v29.21,0
A3  (via drill 0.76)
  Top 0.254: U$4.6 31.75,6.7 JP1.9
  Top 1.524: JP1.9 v31.75,0
  Bottom 1.524: JP1.9 v31.75,0
A4  (via drill 0.76)
  Top 0.254: JP1.8 34.29,2.29 33.4,3.17 33.4,7.65 U$4.7
  Top 1.524: JP1.8 v34.29,0
  Bottom 1.524: JP1.8 v34.29,0
A5  (via drill 0.76)
  Top 0.254: U$4.9 34.54,7.38 34.54,4.57 36.83,2.29 JP1.7
  Top 1.524: JP1.7 v36.83,0
  Bottom 1.524: JP1.7 v36.83,0
AGND  (via drill 0.33)
  Top 0.254: U$4.47 33.27,11.81 33.53,11.81 v34.54,12.83 34.61,12.89 | 34.61,12.89 35.31,13.59 35.31,14.02 U$4.41 | U$4.44 34.44,12.76 34.61,12.89 | v23.37,2.39 22.25,1.27 21.79,1.27
  other vias: 31.37,10.16 25.4,0.76 27.94,0.76 30.48,0.76 33.02,0.76 35.56,0.76 36.58,3.56 22.86,0.76
  pour Top (no thermals): 37.59,-0.38 37.59,3.17 35.05,5.84 35.05,7.24 35.69,7.87 35.69,8.64 33.53,10.79 33.53,11.3 35.51,13.28 35.51,14.4 34.85,15.06 34.49,15.06 33.4,13.97 33.4,13.46 34.04,12.83 33.27,12.06 32.51,12.83 30.99,12.83 29.46,11.3 29.46,6.22 26.67,3.43 23.62,3.43 22.35,2.16 22.35,-0.38
  pour Bottom (no thermals): 37.59,-0.38 37.59,3.17 35.05,5.84 35.05,7.24 35.69,7.87 35.69,8.64 33.53,10.79 33.53,11.3 35.51,13.28 35.51,14.4 34.85,15.06 34.49,15.06 33.4,13.97 33.4,13.46 34.04,12.83 34.04,12.83 31.75,10.54 31.24,10.54 30.99,10.29 30.99,9.78 29.46,8.25 29.46,6.22 26.67,3.43 23.62,3.43 22.35,2.16 22.35,-0.38
D_N
  Top 0.152: U4.5 6.97,10.49 6.88,10.49
  Top 0.254: USB1.D- 4.7,7.72 5.62,7.72 6.88,8.98 6.88,10.49 6.88,11.23 6.48,11.64 U4.2 6.43,12.43 6.43,13.63 6.82,14.02 7.1,14.02 R103.1
D_P
  Top 0.254: USB1.D+ 4.71,8.13 5.45,8.13 6.48,9.15 6.48,11.07 5.98,11.57 U4.3 6.02,12.42 6.02,13.8 6.65,14.43 7.1,14.43 R104.1
EN  (via drill 0.76)
  Top 0.254: JP3.2 26.67,18.03 27.18,17.53 27.18,16.79 | 27.18,16.79 27.18,16.34 26.54,15.71 R9.2 | U2.3 27.18,16.79
  Top 1.524: JP3.2 v26.67,22.86
  Bottom 1.524: JP3.2 v26.67,22.86
EZFET_AVBUS  (via drill 0.3)
  Top 0.203: MSP101.1 10.44,14.73 11.05,14.73 11.18,14.61
  Top 0.254: R125.1 v9.02,0.97 C123.2 R124.2 | v11.71,12.45 11.94,12.68 11.94,13.84 11.18,14.61
  Bottom 0.254: v11.71,12.45 11.71,10.9 12.45,10.16 12.45,9.4 9.02,5.97 v9.02,0.97
EZFET_AVCCOUT2ADC  (via drill 0.3)
  Top 0.254: C122.2 v6.63,0.97 R122.1 R121.2 | v11.3,13.33 11.3,13.84 10.85,14.3 MSP101.2
  Bottom 0.254: v11.3,13.33 11.07,13.11 11.07,10.9 11.94,10.03 11.94,9.53 6.63,4.22 v6.63,0.97
EZFET_D_N  (via drill 0.3)
  Top 0.254: C110.1 17.22,16.79 16.98,16.55 MSP101.52 16.98,14.49 v17.12,14.35 | R103.2 8.91,14.02 9.27,14.02 v9.27,13.82
  Bottom 0.254: v9.27,13.82 9.27,14.02 14.56,14.02 15.71,15.16 17.06,15.16 17.32,14.9 17.32,14.35 v17.12,14.35
EZFET_D_P  (via drill 0.3)
  Top 0.152: R105.1 C111.1 R106.2
  Top 0.254: R105.1 18.92,16.89 17.98,15.95 MSP101.50 17.98,14.4 v17.93,14.35 | R104.2 8.91,14.43 9.27,14.43 v9.27,14.63
  Bottom 0.254: v9.27,14.63 9.27,14.43 14.39,14.43 15.54,15.57 17.23,15.57 17.73,15.07 17.73,14.35 v17.93,14.35
EZFET_LED0
  Top 0.254: R101.2 12.48,5.76 MSP101.20
EZFET_LED1
  Top 0.254: R102.2 13.34,5.71 12.98,6.07 MSP101.21
EZFET_PUR
  Top 0.254: MSP101.51 17.48,16.21 18.16,16.89 18.16,17.57 R105.2 18.67,18.29
EZFET_RST  (via drill 0.3)
  Top 0.254: MSP101.64 10.98,15.69 v10.41,16.26 10.2,16.47 R3.1
  Bottom 0.254: U$1.7 6.86,19.14 9.74,16.26 v10.41,16.26
EZFET_SBW_NC
  Top 0.254: MSP101.45 19.52,13.3 21.21,14.99 U$2.1
EZFET_SBW_RST
  Top 0.254: MSP101.43 19.79,12.3 19.94,12.45 U$2.3
EZFET_SBW_TST
  Top 0.254: MSP101.44 19.66,12.8 20.57,13.72 U$2.2
EZFET_TCK  (via drill 0.3)
  Top 0.254: v11.3,16.38 11.48,16.2 MSP101.63
  Bottom 0.254: U$1.6 8.13,19.56 v11.3,16.38
EZFET_TDI  (via drill 0.3)
  Top 0.254: MSP101.61 12.48,17.49 v11.81,18.16
  Bottom 0.254: v11.81,18.16 10.67,19.3 U$1.4
EZFET_TDO  (via drill 0.3)
  Top 0.254: MSP101.60 12.98,18.01 v11.94,19.05
  Bottom 0.254: v11.94,19.05 U$1.3
EZFET_TEST  (via drill 0.3)
  Top 0.254: MSP101.59 13.48,18.39 v12.95,18.92
  Bottom 0.254: U$1.2 13.21,21.46 12.57,20.83 12.57,19.3 v12.95,18.92
EZFET_TMS  (via drill 0.3)
  Top 0.254: v11.81,17.14 11.98,16.97 MSP101.62
  Bottom 0.254: U$1.5 9.4,19.56 v11.81,17.14
EZFET_UARTCTS
  Top 0.254: MSP101.32 20.79,6.69 21.46,7.37 U$2.7
EZFET_UARTRTS
  Top 0.254: MSP101.33 20.38,7.3 21.72,8.64 U$2.6
EZFET_UARTRXD
  Top 0.254: MSP101.38 21.86,9.8 U$2.5
EZFET_UARTTXD  (via drill 0.3)
  Top 0.254: MSP101.37 19.78,9.3 20.19,8.89 v20.19,8.64
  Bottom 0.254: v20.19,8.64 20.19,9.88 21.49,11.18 U$2.4
EZFET_V18
  Top 0.254: MSP101.55 15.48,16.55 15.24,16.79 C102.1
EZFET_VBUS  (via drill 0.3)
  Top 0.254: MSP101.53 16.48,14.58 v16.26,14.35 | v11.56,2.03 10.71,2.03 R124.1
  Bottom 0.254: v16.26,14.35 16.26,14.1 15.75,13.59 13.72,13.59 12.7,12.57 12.7,10.79 12.95,10.54 12.95,9.14 10.67,6.86 10.67,2.92 v11.56,2.03
EZFET_VCC  (via drill 0.3)
  Top 0.254: MSP101.11 11.16,9.8 v11.18,9.78 11.18,9.02 11.94,8.25 17.53,8.25 17.91,8.64 v17.91,10.16 | R109.2 8.64,16.34 v8.64,16 | MSP101.40 v19.82,10.8 20.36,10.8 C113.1 | v6.99,6.86 8.51,6.86 | 8.51,6.86 9.19,7.54 C103.1 9.26,7.8 MSP101.15 | 8.51,6.86 8.51,6 | 8.51,6 8.51,5.71 9.91,4.32 10.29,4.32 11.05,3.56 C10.1 | U1.5 8.51,6 | v4.95,2.79 4.95,2.75 4.87,2.75 v4.95,2.79 | v4.95,2.79 R121.1 | C4.1 3.98,2.79 v4.95,2.79
  Bottom 0.254: v8.64,16 8.64,12.32 v11.18,9.78 | v11.18,9.78 10.92,9.78 | U$2.8 18.41,6.1 17.91,6.6 v17.91,10.16 19.18,10.16 v19.82,10.8 | v11.18,9.78 8.26,6.86 v6.99,6.86 6.99,6.22 4.95,4.19 v4.95,2.79
EZFET_VREF
  Top 0.254: MSP101.9 9.61,10.79 C121.1
EZFET_VUSB
  Top 0.254: MSP101.54 15.98,16.96 C107.1
EZFET_XT2IN
  Top 0.254: MSP101.57 14.48,18.92 14.99,19.43 18.67,19.43 19.28,20.04 Q101.1
EZFET_XT2OUT
  Top 0.254: MSP101.58 13.98,19.57 15.49,21.08 Q101.3
GND  (via drill 0.3, 0.76)
  Top 1.524: JP1.13 v21.59,0 | JP1.1 v52.07,0
  Bottom 1.524: JP1.13 v21.59,0 | JP1.1 v52.07,0
  other vias: 4.7,21.08 17.91,18.54 7.62,16 20.95,19.3 17.27,22.1 20.32,22.1 14.99,7.62 14.73,11.05 14.73,12.32 16,12.32 16,11.05 16,9.78 14.73,9.78 13.46,12.32 13.46,11.05 13.59,9.78 19.56,16 17.53,2.29 20.19,3.17 27.81,7.24 29.46,18.54 36.83,11.43 36.83,12.7 38.04,11.82 37.58,10.4 36.08,10.4 35.62,11.82 27.43,14.35 33.27,14.86 33.53,16.76 35.56,22.1 33.02,22.1 38.1,22.1 40.64,22.1 43.18,22.1 45.72,22.1 48.26,22.1 50.8,22.1 30.48,22.1 27.94,22.1 25.4,22.1 38.1,0.76 40.64,0.76 43.18,0.76 45.72,0.76 48.26,0.76 50.8,0.76 26.67,11.81 20.32,0.76 17.78,0.76 15.24,0.76 25.78,14.61
  pour Bottom (rank 6, no thermals): 0,0 55.88,0 55.88,22.86 0,22.86
  pour Top (rank 6, no thermals): 0,22.86 0,0 55.88,0 55.88,22.86
MISO  (via drill 0.3, 0.76)
  Top 0.254: v42.29,12.83 42.12,12.83 U$4.25
  Top 1.524: JP1.4 v44.45,0
  Bottom 0.254: JP1.4 44.45,3.94 41.27,7.11 41.27,8.89 42.67,10.29 42.67,12.45 v42.29,12.83
  Bottom 1.524: JP1.4 v44.45,0
MOSI  (via drill 0.3, 0.76)
  Top 0.254: v42.04,10.92 42.02,10.9 U$4.24
  Top 1.524: JP1.5 v41.91,0
  Bottom 0.254: JP1.5 41.91,5.84 40.77,6.98 40.77,9.02 42.04,10.29 v42.04,10.92
  Bottom 1.524: JP1.5 v41.91,0
N$1
  Top 0.254: R2.1 1.86,22.23 4.83,22.23 5.59,21.46 CHG.K
N$2
  Top 0.254: C9.2 R1.2 44.03,4.78 44.49,5.25 R5.1
N$3
  Top 0.254: U3.1 1.27,19.24 R2.2
N$4
  Top 0.254: U3.5 3.81,19.24 R8.1
N$5
  Top 0.254: U$4.46 32.33,13.45 X1.P$2
N$6  (via drill 0.3)
  Top 0.254: v46.1,17.91 44.83,16.64 44.83,14.35 43.39,12.91 R11.1
  Bottom 0.254: U$10.3 27.43,12.45 32.89,17.91 v46.1,17.91
N$7
  Top 0.254: U$4.22 41.21,9.53 41.78,9.53 42.93,8.38 R10.1
N$8
  Top 0.254: R3.2 R109.1 C112.1
N$9  (via drill 0.3)
  Top 0.254: R12.1 42.8,10.24 42.8,11.43 42.93,11.56 43.81,11.56 43.94,11.68 43.94,12.83 45.59,14.48 45.59,16.38 v47.12,17.91
  Bottom 0.254: U$10.2 27.94,13.72 32.89,18.67 46.35,18.67 v47.12,17.91
N$11
  Top 0.254: U$4.45 32.65,13.84 X1.P$1
N$14
  Top 0.254: L1.1 30.39,12.62 C2.1 31.33,11.68 32.13,11.68 U$4.48
N$15
  Top 0.254: L1.2 28.57,10.45 C7.1 28.53,9.19 R6.2
N$18
  Top 0.254: MSP101.17 10.98,6.04 11.18,5.84 11.68,5.84 12.32,5.21 C101.1
N$19
  Top 0.254: R101.1 15.11,4.57 15.37,4.32 LED101.A
N$20
  Top 0.254: R102.1 15.24,5.71 15.37,5.59 LED102.A
RST
  Top 0.254: R5.2 R4.1 43.94,7.66 43.94,9.02 | 43.94,9.02 43.94,10.37 R7.1 | U$4.23 41.41,10.03 41.91,10.03 42.04,9.91 42.93,9.02 43.94,9.02
RST_BTN  (via drill 0.3, 0.76)
  Top 0.254: v26.8,5.33 26.8,4.44 26.29,3.94 19.18,3.94 18.16,2.92 16.51,2.92 14.86,1.27 JP1.16 | v31.5,12.57 31.5,12.95 30.99,13.46 30.99,13.84 32.89,15.75 32.89,17.02 33.27,17.4 33.78,17.4 v34.42,16.76 | R7.2 R11.2 45,12.7 U$5.3 50.29,15.37 v50.29,17.14
  Top 1.524: JP1.16 v13.97,0
  Bottom 0.254: v26.8,5.33 28.96,7.49 28.96,9.14 31.5,11.68 v31.5,12.57 | 34.54,16.64 v34.42,16.76 34.8,17.14 v50.29,17.14
  Bottom 1.524: JP1.16 v13.97,0
RX  (via drill 0.3, 0.76)
  Top 0.254: U$4.21 41.52,8.51 v41.91,8.51
  Top 1.524: JP1.3 v46.99,0
  Bottom 0.254: U$10.5 27.05,9.91 32.64,15.49 36.96,15.49 37.08,15.62 43.94,15.62 44.32,15.24 44.32,10.54 42.29,8.51 v41.91,8.51 41.91,7.37 46.99,2.29 JP1.3
  Bottom 1.524: JP1.3 v46.99,0
SCK  (via drill 0.76)
  Top 0.254: U$4.11 35.56,6.98 35.56,6.1 39.37,2.29 JP1.6
  Top 1.524: JP1.6 v39.37,0
  Bottom 1.524: JP1.6 v39.37,0
SCL  (via drill 0.3, 0.33, 0.76)
  Top 0.254: U$4.32 38.28,13.95 v37.95,13.95 | JP3.11 49.53,21.46 48.39,20.32 46.74,20.32 43.56,17.14 v43.56,14.99
  Top 1.524: JP3.11 v49.53,22.86
  Bottom 0.254: v37.95,13.95 38.99,14.99 v43.56,14.99
  Bottom 1.524: JP3.11 v49.53,22.86
SDA  (via drill 0.3, 0.33, 0.76)
  Top 0.254: U$4.31 38.61,13.56 v38.61,13.28 | JP3.12 52.07,21.08 50.8,19.81 46.99,19.81 44.32,17.14 44.32,14.73 43.18,13.59 v43.05,13.59
  Top 1.524: JP3.12 v52.07,22.86
  Bottom 0.254: v38.61,13.28 38.91,13.59 v43.05,13.59
  Bottom 1.524: JP3.12 v52.07,22.86
TST
  Top 0.254: R10.2 R12.2 47.12,9.65 U$5.2
TX  (via drill 0.3, 0.76)
  Top 0.254: U$4.20 41.57,7.75 v42.55,7.75
  Top 1.524: JP1.2 v49.53,0
  Bottom 0.254: U$10.4 27.69,11.18 32.64,16.13 44.2,16.13 44.83,15.49 44.83,7.75 | 44.83,7.75 44.83,5.97 JP1.2 | v42.55,7.75 44.83,7.75
  Bottom 1.524: 49.53,1.14 v49.53,0
VBAT  (via drill 0.3, 0.76)
  Top 0.254: U3.3 2.54,17.34 | 2.54,17.34 2.54,18.16 | 2.54,18.16 C3.1 | 2.54,17.34 2.54,16.26 JP2.1 | v13.84,20.7 7.49,20.7 6.48,19.69 6.48,18.54 6.1,18.16 2.54,18.16 | JP3.1 24.13,18.85 D4.A | U1.3 9.59,4 9.14,4.44 8.13,4.44 | 8.13,4.44 7.69,4 U1.1 6.29,3.4 C5.1 4.03,3.47 v3.94,3.56 | 8.13,4.44 7.87,4.44 7.11,5.21 7.11,5.84 6.86,6.1 v5.84,6.1
  Top 1.524: JP3.1 v24.13,22.86
  Bottom 0.254: JP3.1 23.24,20.7 v13.84,20.7 | v5.84,6.1 5.08,6.1 3.94,7.24 JP2.1
  Bottom 1.524: JP3.1 v24.13,22.86
VBUS  (via drill 0.3, 0.76)
  Top 0.254: U4.1 6.98,11.82 7.49,11.3 v7.75,11.3 8,11.05 C1.2 | U3.4 CHG.A | v5.59,16.13 CHG.A | v13.34,19.94 7.62,19.94 7.11,19.43 7.11,18.29 6.17,17.35 CHG.A | JP3.3 29.21,19.74 29.18,19.71 | v5.71,6.98 5.68,6.96 USB1.VBUS | 29.84,16.13 30.16,16.44 U2.1 30.16,18.73 29.18,19.71 | 27.73,18.41 D4.C 28.26,18.79 29.18,19.71 | v26.27,17.49 26.42,17.34 R9.1 25.87,16.26 C6.1
  Top 1.524: JP3.3 v29.21,22.86
  Bottom 0.254: v5.59,16.13 5.59,13.46 v7.75,11.3 7.75,9.02 v5.71,6.98 | v13.34,19.94 26.27,19.94 | 26.27,19.94 27.56,19.94 JP3.3 | v26.27,17.49 26.27,19.94
  Bottom 1.524: JP3.3 v29.21,22.86
VCC  (via drill 0.3, 0.76)
  Top 0.254: v28.19,5.59 27.69,6.1 27.18,6.1 | U$10.8 27.18,6.1 | 27.18,6.1 R6.1 26.84,8.09 26.04,8.89 26.04,13.97 27.62,15.55 30.16,15.55 | U2.5 30.16,15.55 | v36.83,14.86 36.83,15.32 U$4.37 35.44,16.71 C11.2 35.35,16.72 34.16,17.91 33.15,17.91 32,16.76 C8.1 31.14,15.55 30.16,15.55 | U$5.1 46.48,6.48 44.07,6.48 43.94,6.35 43.94,5.33 43.81,5.21 42.84,5.21 R1.1 41.06,6.98 v40.01,6.98
  Top 1.524: JP1.15 v16.51,0
  Bottom 0.254: v28.19,5.59 26.54,3.94 19.18,3.94 18.41,3.17 18.41,2.29 17.4,1.27 JP1.15 | v40.01,6.98 40.01,8.89 40.64,9.53 40.64,10.29 36.83,14.1 v36.83,14.86
  Bottom 1.524: JP1.15 v16.51,0
VREF+  (via drill 0.76)
  Top 0.254: U$4.2 29.72,7.5 29.72,5.84 26.92,3.05 21.34,3.05 20.7,2.41 20.19,2.41 JP1.14
  Top 1.524: JP1.14 v19.05,0
  Bottom 1.524: JP1.14 v19.05,0

### Text on the board
tPlace: BAT | En | USB | 13 | 12 | 11 | 10 | 9 | 6 | 5 | SCL | SDA | CHRG | GND | + | NC | TST | RST | !RST | TXD | TST | RXD | RTS | CTS | VCC | VCC | GND | RST | 3V | ARf | GND | A0 | A1 | A2 | A3 | A4 | A5 | SCK | MOSI | MISO | RX | TX | GND
bPlace: BAT | En | USB | 13 | 12 | 11 | 10 | 9 | 6 | 5 | SCL | SDA | Joseph Woodrell | RST | 3V | ARf | GND | A0 | A1 | A2 | A3 | A4 | A5 | SCK | MOSI | MISO | RX | TX | GND